# Altium schematic sheet Clock.SchDoc: Clock
size A4; Author: Ben Eater; DrawnBy: LittleYe233; DocumentNumber: 1; SheetNumber: 1; SheetTotal: 8
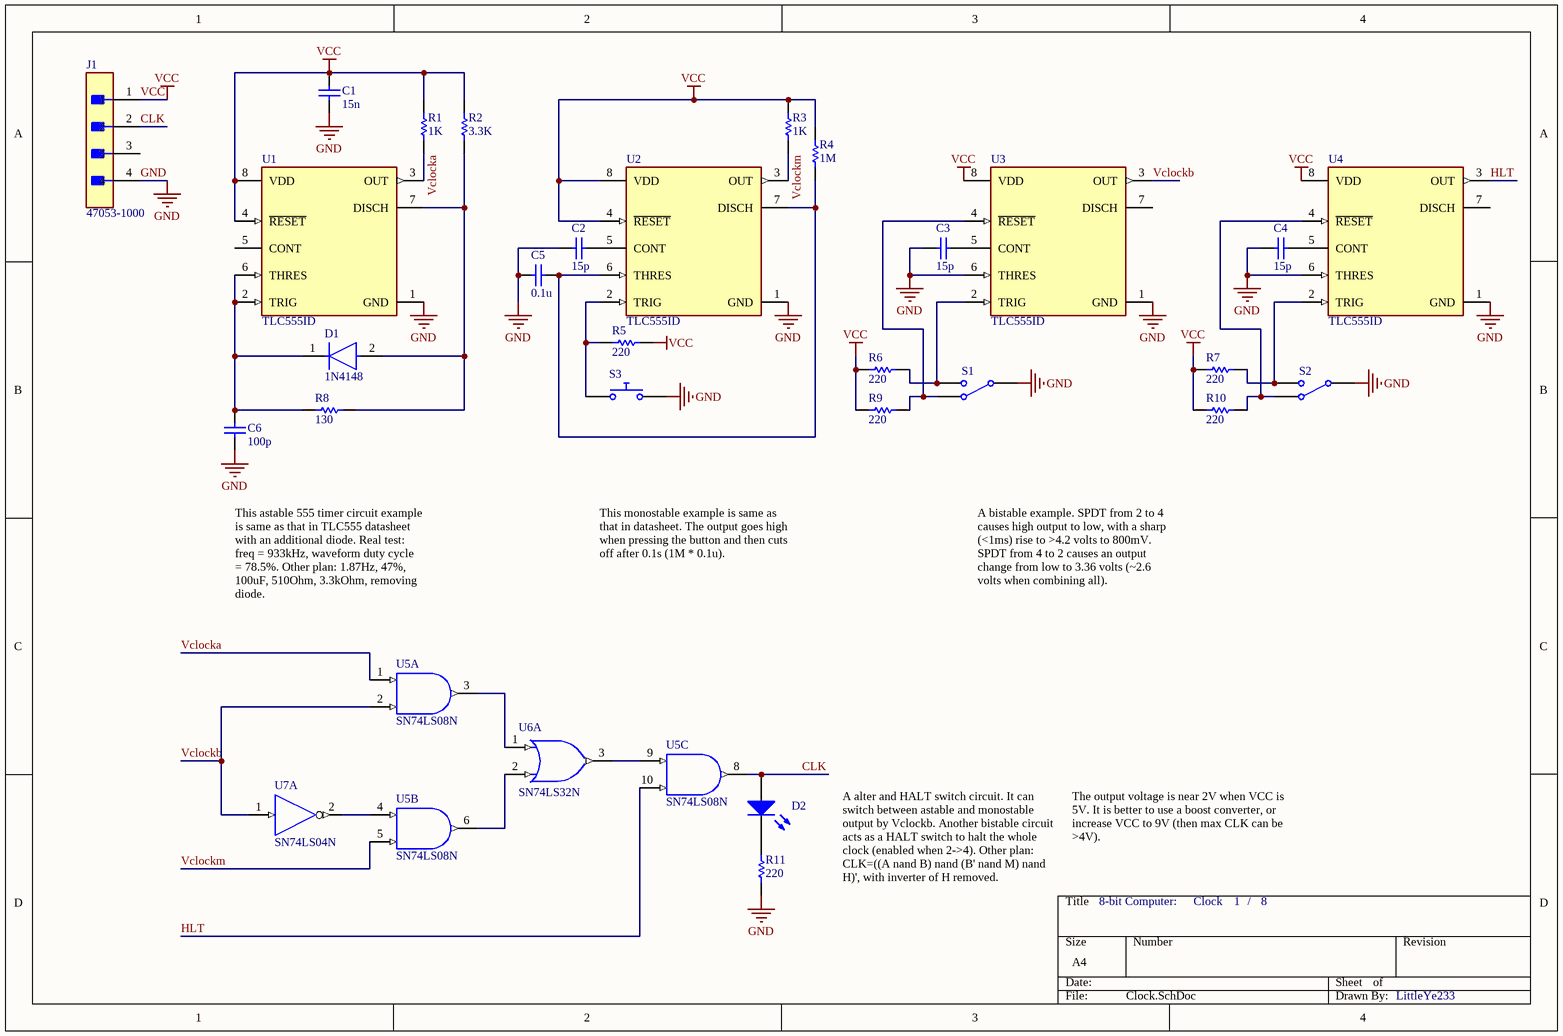
[diagram p0: Clock.SchDoc]

## Parts
C1  value 15n  (hidden comment: Capacitor)
C2  value 15p  (hidden comment: Capacitor)
C3  value 15p  (hidden comment: Capacitor)
C4  value 15p  (hidden comment: Capacitor)
C5  value 0.1u  (hidden comment: Capacitor)
C6  value 100p  (hidden comment: Capacitor)
D1  1N4148  [FP-017AG-MFG]
D2  Light-Emitting Diode  (value not drawn)
J1  47053-1000  [FP-470531000-MFG]
R1  value 1K  (hidden comment: Resistor)
R2  value 3.3K  (hidden comment: Resistor)
R3  value 1K  (hidden comment: Resistor)
R4  value 1M  (hidden comment: Resistor)
R5  value 220  (hidden comment: Resistor)
R6  value 220  (hidden comment: Resistor)
R7  value 220  (hidden comment: Resistor)
R8  value 130  (hidden comment: Resistor)
R9  value 220  (hidden comment: Resistor)
R10  value 220  (hidden comment: Resistor)
R11  value 220  (hidden comment: Resistor)
S1  Single-Pole, Double-Throw Switch  (value not drawn)
S2  Single-Pole, Double-Throw Switch  (value not drawn)
S3  Push Button Normally Opened  (value not drawn)
U1  TLC555ID  [FP-D0008A-IPC_B]
U2  TLC555ID  [FP-D0008A-IPC_B]
U3  TLC555ID  [FP-D0008A-IPC_B]
U4  TLC555ID  [FP-D0008A-IPC_B]
U5  SN74LS08N  [N0014A]  (parts A,B,C of 5)
U6  SN74LS32N  [N0014A]  (part A of 5)
U7  SN74LS04N  [N0014A]  (part A of 7)

## Nets
GND: C1.1 C2.2 C3.2 C4.2 C5.2 C6.1 J1.4 R11.1 S1.1 S2.1 S3.2 U1.1(GND) U2.1(GND) U3.1(GND) U3.6(THRES) U4.1(GND) U4.6(THRES)
VCC: C1.2 J1.1 R1.2 R2.2 R3.2 R4.2 R5.1 R6.1 R7.1 R9.2 R10.2 U1.4(~{RESET}) U1.8(VDD) U2.4(~{RESET}) U2.8(VDD) U3.8(VDD) U4.8(VDD)
CLK: D2.1(A) J1.2 U5.8(3Y)
HLT: U4.3(OUT) U5.10(3B)
Vclocka: R1.1 U1.3(OUT) U5.1(1A)
Vclockb: U3.3(OUT) U5.2(1B) U7.1(1A)
Vclockm: R3.1 U2.3(OUT) U5.5(2B)
NetC2_1: C2.1 U2.5(CONT)
NetC3_1: C3.1 U3.5(CONT)
NetC4_1: C4.1 U4.5(CONT)
NetC5_1: C5.1 R4.1 U2.6(THRES) U2.7(DISCH)
NetC6_2: C6.2 D1.1(C) R8.1 U1.2(TRIG) U1.6(THRES)
NetD1_2: D1.2(A) R2.1 R8.2 U1.7(DISCH)
NetD2_2: D2.2(K) R11.2
NetR5_2: R5.2 S3.1 U2.2(TRIG)
NetR6_2: R6.2 S1.2 U3.2(TRIG)
NetR7_2: R7.2 S2.2 U4.2(TRIG)
NetR9_1: R9.1 S1.3 U3.4(~{RESET})
NetR10_1: R10.1 S2.3 U4.4(~{RESET})
NetU5_3: U5.3(1Y) U6.1(1A)
NetU5_4: U5.4(2A) U7.2(~{1Y})
NetU5_6: U5.6(2Y) U6.2(1B)
NetU5_9: U5.9(3A) U6.3(1Y)

Not connected (* = marked no-connect by the designer): J1 3; U1 5(CONT); U3 7(DISCH); U4 7(DISCH)

## Notes on the sheet
- This monostable example is same as that in datasheet. The output goes high when pressing the button and then cuts off after 0.1s (1M * 0.1u).
- A bistable example. SPDT from 2 to 4 causes high output to low, with a sharp (<1ms) rise to >4.2 volts to 800mV. SPDT from 4 to 2 causes an output change from low to 3.36 volts (~2.6 volts when combining all).
- This astable 555 timer circuit example is same as that in TLC555 datasheet with an additional diode. Real test: freq = 933kHz, waveform duty cycle = 78.5%. Other plan: 1.87Hz, 47%, 100uF, 510Ohm, 3.3kOhm, removing diode.
- The output voltage is near 2V when VCC is 5V. It is better to use a boost converter, or increase VCC to 9V (then max CLK can be >4V).
- A alter and HALT switch circuit. It can switch between astable and monostable output by Vclockb. Another bistable circuit acts as a HALT switch to halt the whole clock (enabled when 2->4). Other plan: CLK=((A nand B) nand (B' nand M) nand H)', with inverter of H removed.
- 8-bit Computer:
- /

## Library data of the parts
C1-C6 = Capacitor: SimulationGenericComponent: True
D1 = CMP-07163-000046-1: DIODE GEN PURP 100V 200MA DO35; Forward Voltage: 1V; Max Power Dissipation: 500mW; Max Reverse Current: 5uA; Forward Current: 300mA; Current: 4A; Reverse Recovery Time: 4ns; Element Configuration: Single; Outside Diameter: 1.85mm; Capacitance: 4pF; Polarity: Standard; Max Forward Surge Current (Ifsm): 1A; Reverse Voltage: 100V; Output Current: 200mA; Average Rectified Current: 200mA; Diameter: 1.91mm; Max Repetitive Reverse Voltage (Vrrm): 100V; Current Rating: 200mA; Case/Package: DO-35; Lead Free: Lead Free; Number of Pins: 2; Recovery Time: 4ns; Packaging: Bulk; Contact Plating: Tin; Voltage: 100V; Mount: Through Hole; Max Surge Current: 4A; Package Quantity: 2000; Width: 1.91mm; Max Reverse Voltage (DC): 100V; Length: 4.56mm; Radiation Hardening: No; Power Dissipation: 500mW; Voltage Rating (DC): 100V; Peak Non-Repetitive Surge Current: 4A; REACH SVHC: No SVHC; Height: 4.56mm; Max Operating Temperature: 175°C; Series: -; Weight: 0.01lb; Min Operating Temperature: -65°C
D2 = LED: AF: 1; BV: 0; BV_MAX: 1e99; EG: 1.11; FC: 0.5; IBV: 0.001; IS: 1e-14; MJSW: 0.33; NTUN: 30; TNOM: 27; XTI: 3; SimulationGenericComponent: True; CJO: 0; CJP: 0; CTA: 0; CTP: 0; FCS: 0.5; FV_MAX: 1e99; IKF: 0; IKR: 0; ISR: 1e-14; JSW: 0; JTUN: 0; JTUNSW: 0; KEG: 1; KF: 0; LEVEL: 1; N: 1; NBV: 1; NR: 1; NS: 1; PHP: 1; RS: 0; TCV: 0; TLEV: 0; TLEVC: 0; TM1: 0; TM2: 0; TPB: 0; TPHP: 0; TRS: 0; TRS2: 0; TT: 0; TTT1: 0; TTT2: 0; VJ: 1; XTITUN: 3
J1 = CMP-04776-000290-2: CONN HEADER VERT 4POS 2.54MM; NexarPartId: 854935; Manufacturer Lifecycle Status: ACTIVE; Voltage Rating (DC): 250V; Gender: Male; Plating: Copper; Number of Positions: 4; Glow Wire Compliant: Non-compliant; Current Rating: 500mA; Max Operating Temperature: 75°C; Number of Rows: 1; REACH SVHC: Unknown; Ambient Temperature Range High: 105°C; Pitch: 2.54mm; Height: 7.7mm; Min Operating Temperature: 0°C; Packaging: Bulk; Contact Material: Brass, Copper; Contact Plating: Tin; Lead Pitch: 2.54mm; Voltage Rating: 250V; Termination: Through Hole; Radiation Hardening: No; Orientation: Vertical; Mount: Through Hole; Number of Pins: 4; Country of Origin: HK; Halogen Free: Low Halogen; Lifecycle Status: Production; Number of Circuits: 4; Schedule B: 8536694040, 8536694040|8536694040|8536694040|8536694040|8536694040|8536694040|8536694040|8536694040|8536694040|8536694040|8536694040|8536694040|8536694040|8536694040|8536694040|8536694040|8536694040|8536694040|8536694040|8536694040|8536694040|8536694040|8536694040|85; Housing Color: Beige; Housing Material: Nylon; Depth: 5.84mm; RoHS: Compliant; Length: 10.2mm; Number of Contacts: 4
R1-R11 = Resistor: TC1: 0; SimulationGenericComponent: True; TC2: 0
S1 S2 = SPDT SW: nodeUP_closed: 1; Rclosed: 1m; Ropen: 1Meg; SimulationGenericComponent: True
S3 = Push Button NO: closed: 0; Rclosed: 1m; Ropen: 1Meg; SimulationGenericComponent: True
U1-U4 = CMP-04858-000007-1: IC OSC SGL TIMER 2.1MHZ 8-SOIC; Manufacturer: Texas Instruments; Nominal Supply Current: 170-360uA; Min Supply Voltage: 3V; Max Supply Voltage: 15V; Number Of Timers/Counters: 1; Standoff Height: 0.11mm; RoHS: TRUE; Package: D0008A; Automotive: No; ComponentLink2Description: Datasheet; Category: IC; Mouser Description: Timers & Support Products CMOS; Ambient Temperature Range High: +85°C; Device Class L1: Integrated Circuits (ICs); Lead Free: Yes; Temperature: -40°C to +85°C; Frequency: 2.1MHz; Device Class L2: Clock and Timing; ComponentLink2URL: http://www.ti.com/lit/ds/symlink/tlc555.pdf; Ambient Temperature Range Low: -40°C; Device Class L3: Timers and Oscillators; Temperature Range High: +85°C; Temperature Range Low: -40°C; Octopart: https://octopart.com/tlc555id-texas+instruments-516571; Digikey Description: IC OSC SGL TIMER 2.1MHZ 8-SOIC; Height: 1.75mm; Manufacturer Part Number: TLC555ID
U5 = CMP-0777-00259-3: Quadruple 2-Input Positive-AND Gates, N0014A, TUBE; Manufacturer: Texas Instruments; VCC(Max)(V): 5.25; ICC @ Nom Voltage(Max)(mA): 0.021; VCC(Min)(V): 4.75; tpd @ Nom Voltage(Max)(ns): 25; Rating: Catalog; Output Type: TTL; Bits(#): 4; Schmitt Trigger: No; Voltage(Nom)(V): 5; Technology Family: LS; F @ Nom Voltage(Max)(Mhz): 35; Output Drive (IOL/IOH)(Max)(mA): -0.8/16; PackageReference: N0014A; DatasheetVersion: SDLS033; Input Type: TTL; Operating Temperature Range(C): 0 to 70; Generic Part Number: SN74LS08
U6 = CMP-1573-00145-3: Quad 2-input positive-OR gates, N0014A, TUBE; Manufacturer: Texas Instruments; tpd @ Nom Voltage(Max)(ns): 22; Output Drive (IOL/IOH)(Max)(mA): 0.8/-16; Input Type: TTL; VCC(Min)(V): 4.75; F @ Nom Voltage(Max)(Mhz): 35; Voltage(Nom)(V): 5; ICC @ Nom Voltage(Max)(mA): 0.038; VCC(Max)(V): 5.25; Rating: Catalog; Bits(#): 4; Generic Part Number: SN74LS32; DatasheetVersion: SDLS100; Operating Temperature Range(C): 0 to 70; Output Type: TTL; Code_JEDEC: MS-001; PackageVersion: http://www.ti.com/lit/ml/mpdi002c/mpdi002c.pdf; PackageReference: N0014A
U7 = CMP-1615-00911-2: Hex inverters, N0014A, TUBE; Manufacturer: Texas Instruments; Output Drive (IOL/IOH)(Max)(mA): -0.4/8; Schmitt Trigger: No; F @ Nom Voltage(Max)(Mhz): 35; Voltage(Nom)(V): 5; Technology Family: LS; Input Type: TTL; Output Type: CMOS; Bits(#): 6; VCC(Max)(V): 5.25; ICC @ Nom Voltage(Max)(mA): 0.033; Rating: Catalog; VCC(Min)(V): 4.75; tpd @ Nom Voltage(Max)(ns): 22; Operating Temperature Range(C): 0 to 70; DatasheetVersion: SDLS029C; Generic Part Number: SN74LS04; Code_JEDEC: MS-001; PackageReference: N0014A